# Altium schematic sheet 电源分线器251017.SchDoc
size A3
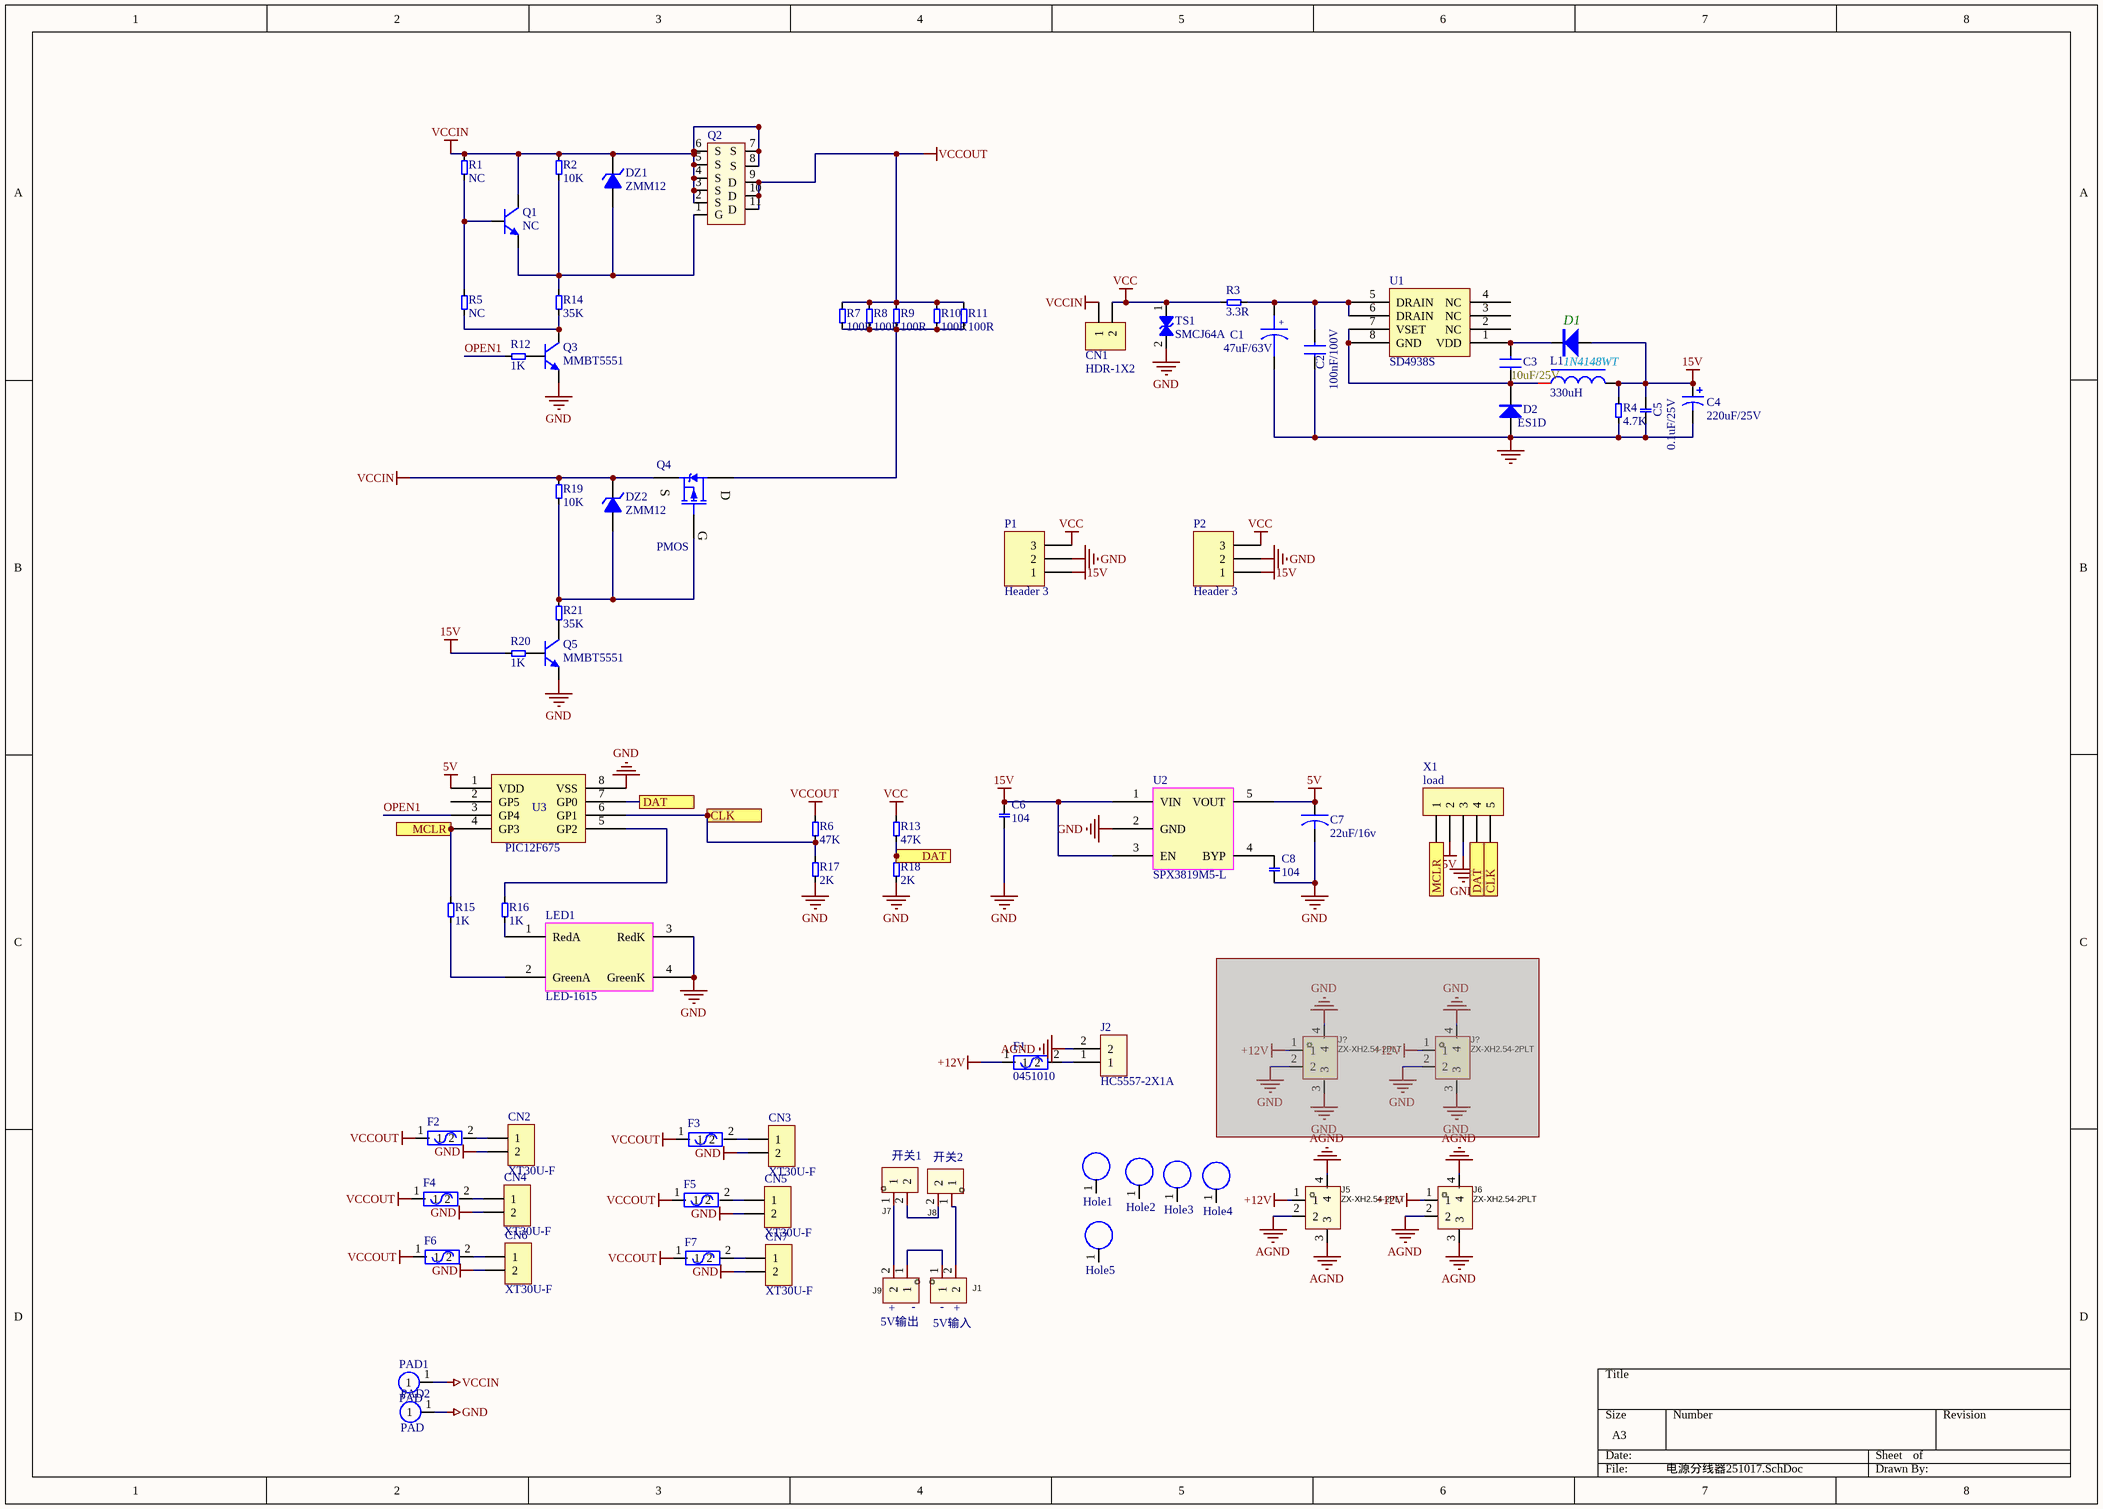
[diagram p0: 电源分线器251017.SchDoc]

## Parts
(Parts that share a designator on the sheet are numbered #1, #2 ... from top to bottom, then left to right.)
C1  47uF/63V  [CT 6*6 - C]
C2  100nF/100V  [0805C]
C3  10uF/25V  [0603C]
C4  220uF/25V  [CT 6*6 - C]
C5  0.1uF/25V  [0603C]
C6  104  [0603C]
C7  22uF/16v  [C 1206]
C8  104  [0603C]
CN1  HDR-1X2  [XH2.54-2P]
CN2  XT30U-F  [直插XT30UPB-M]
CN3  XT30U-F  [直插XT30UPB-M]
CN4  XT30U-F  [直插XT30UPB-M]
CN5  XT30U-F  [直插XT30UPB-M]
CN6  XT30U-F  [直插XT30UPB-M]
CN7  XT30U-F  [直插XT30UPB-M]
D1  1N4148WT  [SOD-123]
D2  ES1D  [SMA]
DZ1  ZMM12  [SOD-123]
DZ2  ZMM12  [SOD-123]
F1  0451010  [FUSE-SMD_2410_L6.1-W2.7]
F2  (no value)  [QCBXS_S]
F3  (no value)  [QCBXS_S]
F4  (no value)  [QCBXS_S]
F5  (no value)  [QCBXS_S]
F6  (no value)  [QCBXS_S]
F7  (no value)  [QCBXS_S]
Hole1  M3孔  [M3 125X200]  (value not drawn)
Hole2  M3孔  [M3 125X200]  (value not drawn)
Hole3  M3孔  [M3 125X200]  (value not drawn)
Hole4  M3孔  [M3 125X200]  (value not drawn)
Hole5  M3孔  [M3 125X200]  (value not drawn)
J1  MOLEX-直插-2pin  [CONN-M-2P直插TH_430450212]  (value not drawn)
J2  HC5557-2X1A  [CONN-TH_HC-5557-2A]
J5  ZX-XH2.54-2PLT  [CONN-SMD_2P-P2.50_HCTL_HC-XH-2ALT]
J6  ZX-XH2.54-2PLT  [CONN-SMD_2P-P2.50_HCTL_HC-XH-2ALT]
J7  MOLEX-直插-2pin  [CONN-M-2P直插TH_430450212]  (value not drawn)
J8  MOLEX-直插-2pin  [CONN-M-2P直插TH_430450212]  (value not drawn)
J9  MOLEX-直插-2pin  [CONN-M-2P直插TH_430450212]  (value not drawn)
J?#1  ZX-XH2.54-2PLT  [CONN-SMD_2P-P2.50_HCTL_HC-XH-2ALT]  (masked out: inside a compile mask, not in the netlist)
J?#2  ZX-XH2.54-2PLT  [CONN-SMD_2P-P2.50_HCTL_HC-XH-2ALT]  (masked out: inside a compile mask, not in the netlist)
L1  330uH  [CD54]
LED1  LED-1615  [LED 0603-RG]
P1  Header 3  [HDR1X3]
P2  Header 3  [HDR1X3]
PAD1  PAD  [PAD-D8-1mm]
PAD2  PAD  [PAD-D8-1mm]
Q1  NC  [SOT23-3N]
Q2  (no value)  [QFN-11P_NCEP018N85LL]
Q3  MMBT5551  [SOT23-3N]
Q4  PMOS  [TO252]
Q5  MMBT5551  [SOT23-3N]
R1  NC  [0603R]
R2  10K  [0603R]
R3  3.3R  [R 1210]
R4  4.7K  [0603R]
R5  NC  [0603R]
R6  47K  [0603R]
R7  100R  [R 1206]
R8  100R  [R 1206]
R9  100R  [R 1206]
R10  100R  [R 1206]
R11  100R  [R 1206]
R12  1K  [0603R]
R13  47K  [0603R]
R14  35K  [0603R]
R15  1K  [0603R]
R16  1K  [0603R]
R17  2K  [0603R]
R18  2K  [0603R]
R19  10K  [0603R]
R20  1K  [0603R]
R21  35K  [0603R]
TS1  SMCJ64A  [SMC]
U1  SD4938S  [SOP8_L]
U2  SPX3819M5-L  [SOT23-5N]
U3  PIC12F675  [SOP8]
X1  load  [HDR2.0-LI-5P]

## Ports
CLK, DAT, MCLR

## Nets
5V: C7.1 U2.5(VOUT) U3.1(VDD) X1.3(2)
15V: C4.1 C5.1 C6.1 D1.1 L1.2 P1.1 P2.1 R4.1 R20.1 U2.1(VIN) U2.3(EN)
+12V: F1.1 J5.1 J6.1
AGND: J2.2 J5.2 J5.3 J5.4 J6.2 J6.3 J6.4
GND: C1.2 C2.2 C4.2 C5.2 C6.2 C7.2 C8.2 CN2.2 CN3.2 CN4.2 CN5.2 CN6.2 CN7.2 D2.1(A) LED1.3(RedK) LED1.4(GreenK) P1.2 P2.2 PAD2.1 Q3.2(E) Q5.2(E) R4.2 R17.1 R18.1 TS1.2(K) U2.2(GND) U3.8(VSS) X1.5(3)
VCC: CN1.2 P1.3 P2.3 R3.2 R13.2 TS1.1(A)
VCCIN: CN1.1 DZ1.2(K) DZ2.2(K) PAD1.1 Q1.3(C) Q2.2(S) Q2.3(S) Q2.4(S) Q2.5(S) Q2.6(S) Q2.7(S) Q2.8(S) Q4.3(S) R1.2 R2.2 R19.2
VCCOUT: F2.1 F3.1 F4.1 F5.1 F6.1 F7.1 Q2.9(D) Q2.10(D) Q2.11(D) R6.2 R7.2 R8.2 R9.2 R10.2 R11.2
CLK: R6.1 R17.2 U3.6(GP1) X1.9(5) ; port CLK
DAT: R13.1 R18.2 U3.7(GP0) X1.7(4) ; port DAT
MCLR: R15.1 U3.4(GP3) X1.1 ; port MCLR
OPEN1: R12.1 U3.3(GP4)
NetC1_1: C1.1 C2.1 R3.1 U1.5(DRAIN) U1.6(DRAIN)
NetC3_1: C3.1 D1.2 U1.1(VDD)
NetC3_2: C3.2 D2.2(K) L1.1 U1.7(VSET) U1.8(GND)
NetC8_1: C8.1 U2.4(BYP)
NetCN2_1: CN2.1 F2.2
NetCN3_1: CN3.1 F3.2
NetCN4_1: CN4.1 F4.2
NetCN5_1: CN5.1 F5.2
NetCN6_1: CN6.1 F6.2
NetCN7_1: CN7.1 F7.2
NetDZ1_1: DZ1.1(A) Q1.2(E) Q2.1(G) R2.1 R14.2
NetDZ2_1: DZ2.1(A) Q4.1(G) R19.1 R21.2
NetF1_2: F1.2 J2.1
NetJ1_1: J1.1 J9.1
NetJ1_2: J1.2 J8.1
NetJ7_1: J7.1 J9.2
NetJ7_2: J7.2 J8.2
NetLED1_1: LED1.1(RedA) R16.1
NetLED1_2: LED1.2(GreenA) R15.2
NetQ1_1: Q1.1(B) R1.1 R5.1
NetQ3_1: Q3.1(B) R12.2
NetQ3_3: Q3.3(C) R5.2 R14.1
NetQ4_2: Q4.2(D) R7.1 R8.1 R9.1 R10.1 R11.1
NetQ5_1: Q5.1(B) R20.2
NetQ5_3: Q5.3(C) R21.1
NetR16_2: R16.2 U3.5(GP2)

Not connected (* = marked no-connect by the designer): Hole1 1(PAD); Hole2 1(PAD); Hole3 1(PAD); Hole4 1(PAD); Hole5 1(PAD); U1 2(NC) 3(NC) 4(NC); U3 2(GP5)

## Notes on the sheet
- 开关1
- 开关2
- 5V输出
- (near J9) +
- -
- 5V输入
- (near J1) -
- (near J1) +
- (in symbol CAPACITOR POL) +

## Library data of the parts
C1 = CAPACITOR POL: Capacitor
C2 C3 = CAP: Capacitor
C4 = Cap Pol1: Capacitor; Published: 8-Jun-2000; LatestRevisionDate: 17-Jul-2002; LatestRevisionNote: Re-released for DXP Platform.; PackageReference: RB7.6-15; Publisher: Altium Limited; Value: 220uF/25V
C5 C6 C8 = CB
C7 = CAPACITOR
CN1 = Header 2: 2P接插件; 版权归属: 正点原子; BOM名称: 2P接插件; 学习资源: www.openedv.com
CN2-CN7 = XT30-直插: 2P接插件; 版权归属: 正点原子; BOM名称: 2P接插件; 学习资源: www.openedv.com
D1 = D1206
D2 = 1N4007: 整流二极管; 学?: www.ooocke.com
DZ1 DZ2 = 1N4106: 12V/0.5W稳压管; 学: www.ooocke.com
F1-F7 = F-2410: 一次性保险丝0451010
Hole1-Hole5 = M3: 铜柱孔; 版权归属: 正点原子; BOM名称: 铜柱孔; 学习资源: www.openedv.com
J1 J7-J9 = M-2PIN-430450212: Manufacturer: MOLEX; Symbol: 436500315; Add into BOM: yes; Pins Structure: 1x3P; Pitch: 3mm; Number of PINs Per Row: 3; Device: 436500315; Supplier: LCSC; Supplier Part: C293546; Manufacturer Part: 436500315; JLCPCB Part Class: Extended Part; LCSC Part Name: 1x3P 间距:3mm; Supplier Footprint: 插件,P=3mm; Datasheet: https://atta.szlcsc.com/upload/public/pdf/source/20181030/C293740_97A5FCFBAFD2B61EE2054683E868EF65.pdf; Convert to PCB: yes; Mounting Style: -; Row Spacing: -; Number of Pins: 3P; Number of Rows: 1; Reference Series: -; Contact Material: 黄铜
J2 = HC5557-2X1A: 直插端子HC5557-2X1A
J5 J6 J?#1 J?#2 = ZX-XH2.54-2PLT: XH2.54-2PLT; Manufacturer: Megastar(兆星); Add into BOM: yes; Pins Structure: 1x2P; Pitch: 2.5mm; Reference Series: XH; Number of PINs Per Row: 2; Current Rating: 3A; Voltage Rating: 250V; Supplementary Features: 辅助焊脚; Z-Height of the Board: 8mm; X-Length of Bottom Edge on Board (Spacing Line): 10mm; Y-Width of Bottom Edge on Board: 8.3mm; Symbol: ZX-XH2.54-2PLT; Device: ZX-XH2.54-2PLT; LCSC Part Name: 1x2P 间距:2.5mm 立贴 系列:XH; Supplier Part: C7429680; Manufacturer Part: ZX-XH2.54-2PLT; Supplier Footprint: SMD,P=2.5mm; JLCPCB Part Class: Extended Part; Datasheet: https://atta.szlcsc.com/upload/public/pdf/source/20230619/87C018EBE425F10E4B035B436CF5FBBC.pdf; Supplier: LCSC; Convert to PCB: yes; Mounting Type: 立贴; Number of Pins: 2P; Number of Rows: 1; Row Spacing: -; Contact Material: 黄铜; Contact Plating: 锡; Operating Temperature: -25℃~+85℃; Plastic Material: -; Flame Retardant Rating: -; Color: 米色
L1 = Induct: 电感
P1 P2 = Header 3: Header, 3-Pin; LatestRevisionDate: 17-Jul-2002; LatestRevisionNote: Re-released for DXP Platform.; Publisher: Altium Limited
PAD1 PAD2 = PAD-D8-1mm: 焊盘
Q1 Q3 Q5 = 8050-SMD: 高频放大-NPN型; 属: 40V 1.5A 1W 100MHZ; 学: www.ooocke.com
Q2 = N-MOS/NCEP018N85LL: NCEP018N85LL/TOLL
Q4 = IRF540: P沟场效应管; 版权归属: 源创客; BOM名称: P沟场效应管; 学习资源: www.ooocke.com
R1-R21 = R
TS1 = TVS-SMCJ64A: SMC 双向TVS管SMCJ64A; BOM名称: 12V/0.5W稳压管; 版权归属: 正点原子; 学习资源: www.openedv.com
U1 = SD4938
U3 = PIC12C508
X1 = CON5: Connector